# EAGLE design HVRescue_Shield_r212 (EAGLE 5.11)
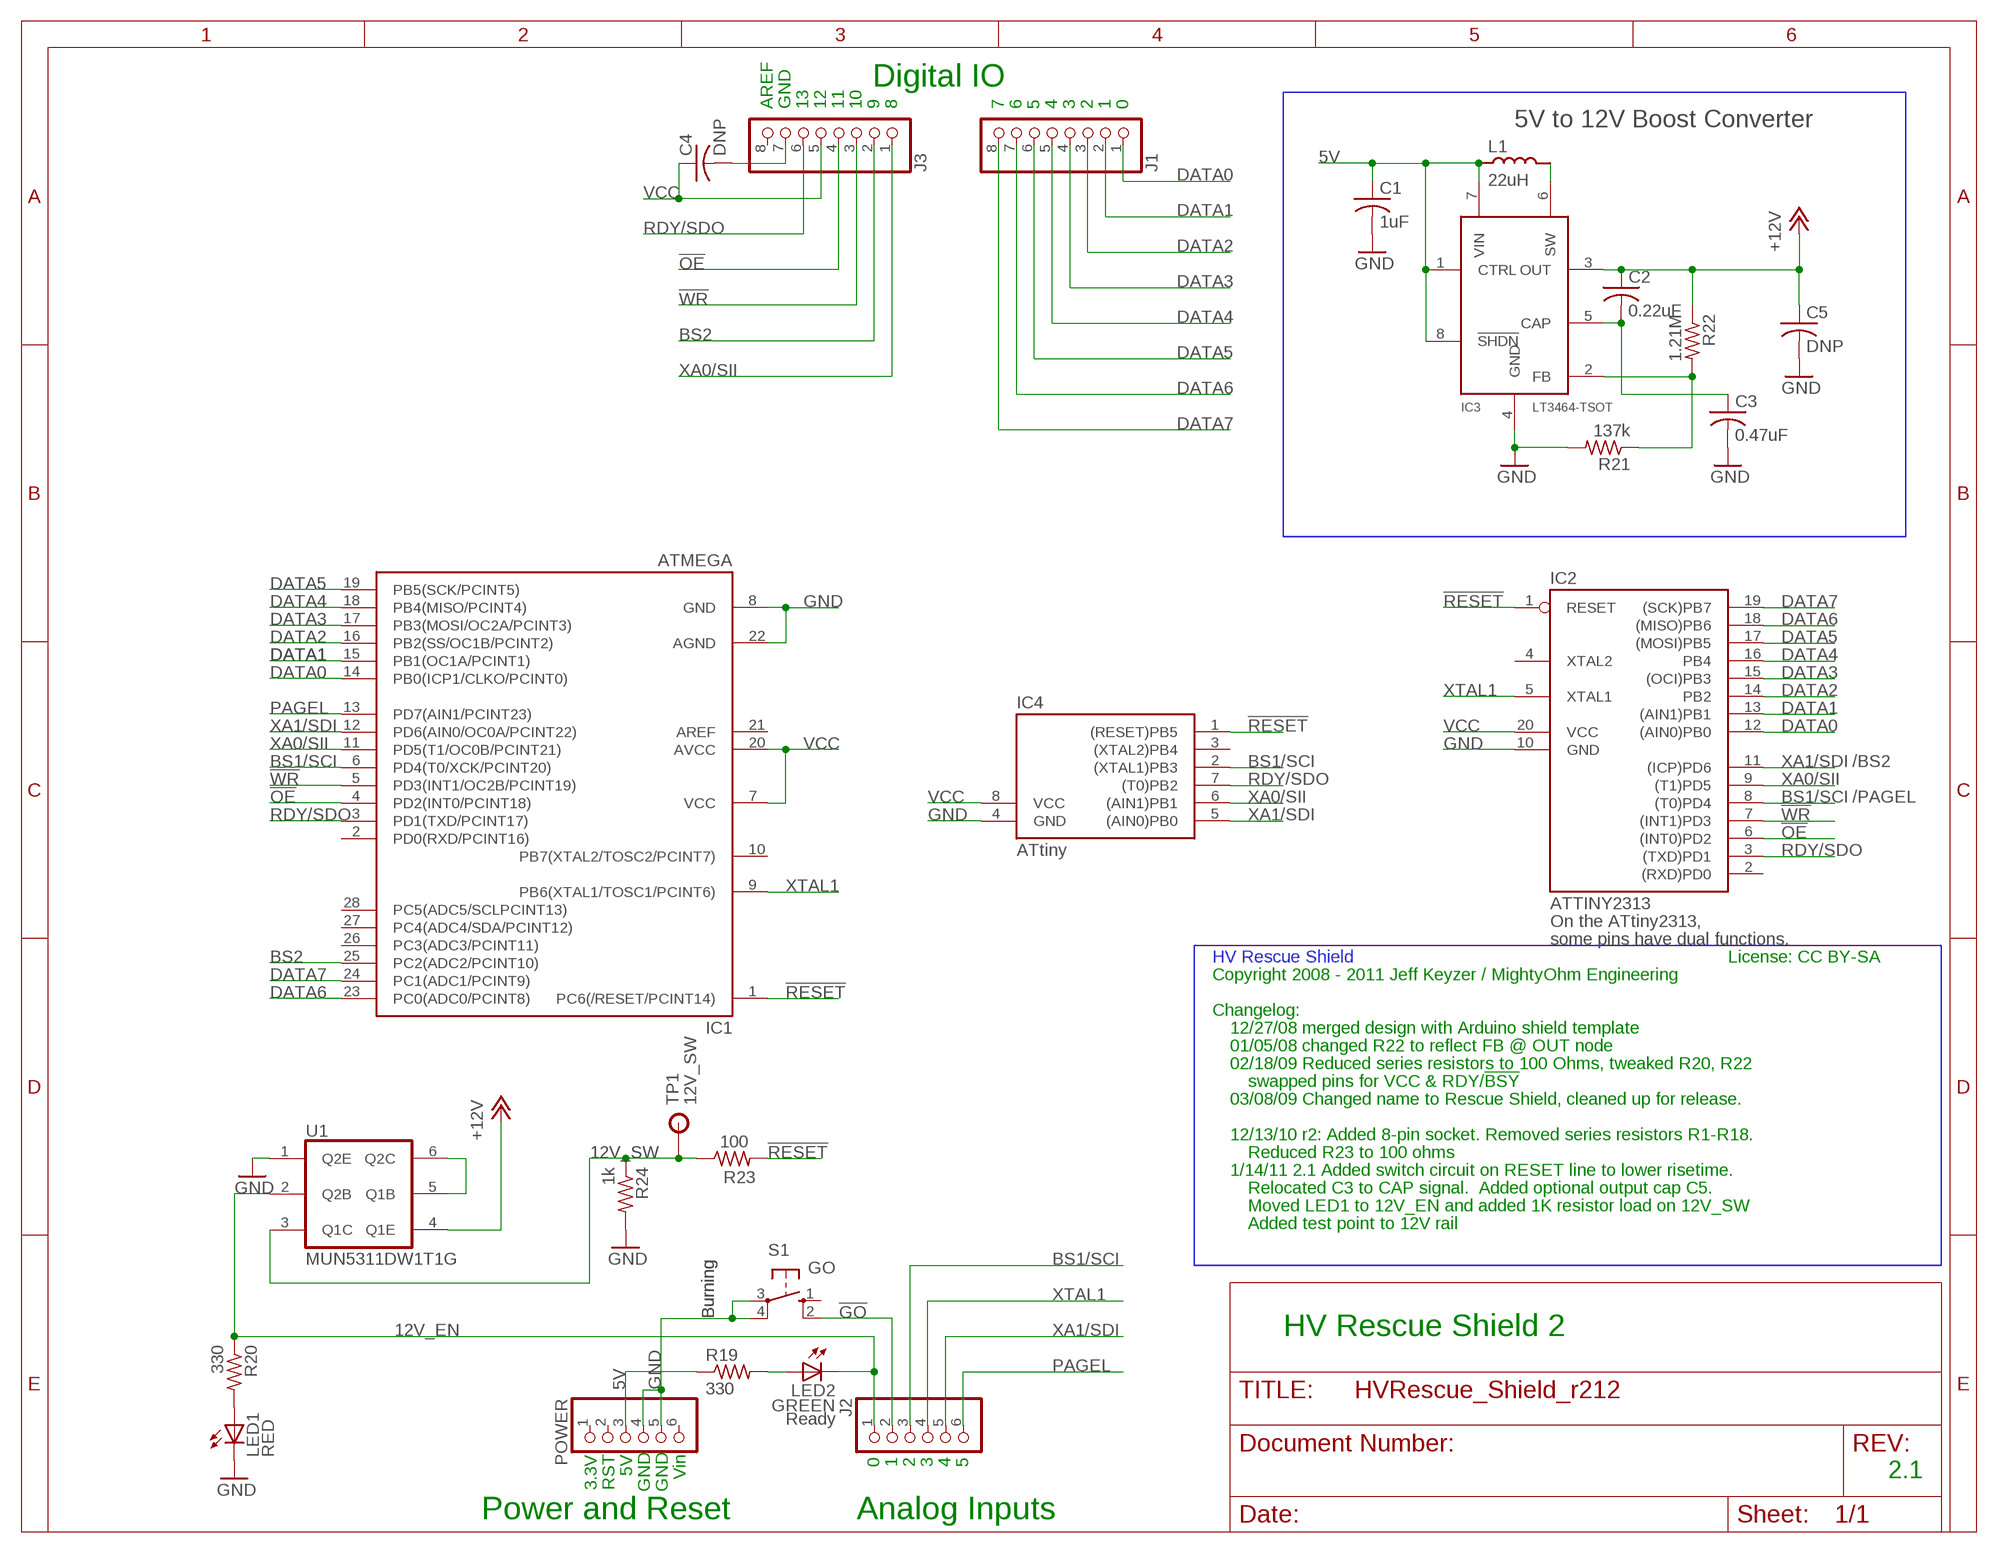
[diagram p0: schematic, sheet 1]

## Parts
C1  1uF  CAP0805  [C0805_IPC]
C2  0.22uF  CAP0805  [C0805_IPC]
C3  0.47uF  CAP0805  [C0805_IPC]
C4  DNP  C-US025-025X050  [C025-025X050]
C5  DNP  CAP0805  [C0805_IPC]
IC1  ATMEGA  MEGA48/88/168-PU  [DIL28-3]
IC2  ATTINY2313  AT90S2313P  [DIL20]
IC3  LT3464-TSOT  [TSOT23-8]
IC4  ATtiny  TINY10P  [DIL08]
J1  PINHD-1X8  [1X08]
J2  PINHD-1X6  [1X06]
J3  PINHD-1X8  [1X08]
L1  22uH  IND0805  [R0805_IPC]
LED1  RED  LED3MM  [LED3MM]
LED2  GREEN  LED3MM  [LED3MM]
POWER  PINHD-1X6  [1X06]
R19  330  R-US_0204/5  [0204/5]
R20  330  R-US_0204/5  [0204/5]
R21  137k  RES0805  [R0805_IPC]
R22  1.21M  RES0805  [R0805_IPC]
R23  100  R-US_0204/5  [0204/5]
R24  1k  RES0805  [R0805_IPC]
S1  GO  10-XX  [B3F-10XX]
TP1  12V_SW  TPPTH  [TP_PTH]
U1  MUN5311DW1T1G  MUN5311  [SOT363]

## Nets
5V: C1.1 IC3.1(CTRL) IC3.7(VIN) IC3.8(!SHDN) L1.1 POWER.3 R19.1
12V_EN: J2.1 LED2.K(C) R20.1 U1.2(Q2B)
12V_SW: R23.1 R24.1 TP1.P$1(TP) U1.3(Q1C)
!GO: J2.2 S1.2(S1)
!OE: IC1.4(PD2(INT0/PCINT18)) IC2.6((INT0)PD2) J3.4
!RESET: IC1.1(PC6(/RESET/PCINT14)) IC2.1(RESET) IC4.1((RESET)PB5) R23.2
!WR: IC1.5(PD3(INT1/OC2B/PCINT19)) IC2.7((INT1)PD3) J3.3
+12V: C2.1 C5.1 IC3.3(OUT) R22.1 U1.4(Q1E)
BS1/SCI: IC1.6(PD4(T0/XCK/PCINT20)) IC2.8((T0)PD4) IC4.2((XTAL1)PB3) J2.3
BS2: IC1.25(PC2(ADC2/PCINT10)) J3.2
CAP: C2.2 C3.1 IC3.5(CAP)
DATA0: IC1.14(PB0(ICP1/CLKO/PCINT0)) IC2.12((AIN0)PB0) J1.1
DATA1: IC1.15(PB1(OC1A/PCINT1)) IC2.13((AIN1)PB1) J1.2
DATA2: IC1.16(PB2(SS/OC1B/PCINT2)) IC2.14(PB2) J1.3
DATA3: IC1.17(PB3(MOSI/OC2A/PCINT3)) IC2.15((OCI)PB3) J1.4
DATA4: IC1.18(PB4(MISO/PCINT4)) IC2.16(PB4) J1.5
DATA5: IC1.19(PB5(SCK/PCINT5)) IC2.17((MOSI)PB5) J1.6
DATA6: IC1.23(PC0(ADC0/PCINT8)) IC2.18((MISO)PB6) J1.7
DATA7: IC1.24(PC1(ADC1/PCINT9)) IC2.19((SCK)PB7) J1.8
GND: C1.2 C3.2 C5.2 IC1.8(GND) IC1.22(AGND) IC2.10(GND) IC3.4(GND) IC4.4(GND) LED1.K(C) POWER.4 POWER.5 R21.2 R24.2 S1.3(P) S1.4(P1) U1.1(Q2E)
N$1: U1.5(Q1B) U1.6(Q2C)
N$2: LED1.A R20.2
N$7: LED2.A R19.2
N$21: C4.2 J3.7
N$44: IC3.6(SW) L1.2
N$46: IC3.2(FB) R21.1 R22.2
PAGEL: IC1.13(PD7(AIN1/PCINT23)) J2.6
RDY/SDO: IC1.3(PD1(TXD/PCINT17)) IC2.3((TXD)PD1) IC4.7((T0)PB2) J3.6
VCC: C4.1 IC1.7(VCC) IC1.20(AVCC) IC2.20(VCC) IC4.8(VCC) J3.5
XA0/SII: IC1.11(PD5(T1/OC0B/PCINT21)) IC2.9((T1)PD5) IC4.6((AIN1)PB1) J3.1
XA1/SDI: IC1.12(PD6(AIN0/OC0A/PCINT22)) IC2.11((ICP)PD6) IC4.5((AIN0)PB0) J2.5
XTAL1: IC1.9(PB6(XTAL1/TOSC1/PCINT6)) IC2.5(XTAL1) J2.4
Unconnected: IC1.2(PD0(RXD/PCINT16)) IC1.10(PB7(XTAL2/TOSC2/PCINT7)) IC1.21(AREF) IC1.26(PC3(ADC3/PCINT11)) IC1.27(PC4(ADC4/SDA/PCINT12)) IC1.28(PC5(ADC5/SCLPCINT13)) IC2.2((RXD)PD0) IC2.4(XTAL2) IC4.3((XTAL2)PB4) J3.8 POWER.1 POWER.2 POWER.6 S1.1(S)

## Notes on the sheet
- Digital IO
- AREF | GND | 13 | 12 | 11 | 10 | 9 | 8 | 7 | 6 | 5 | 4 | 3 | 2 | 1 | 0
- 5V to 12V Boost Converter
- /BS2
- /PAGEL
- On the ATtiny2313,
- some pins have dual functions.
- HV Rescue Shield | License: CC BY-SA
- Copyright 2008 - 2011 Jeff Keyzer / MightyOhm Engineering
- Changelog:
- 12/27/08 merged design with Arduino shield template
- 01/05/08 changed R22 to reflect FB @ OUT node
- 02/18/09 Reduced series resistors to 100 Ohms, tweaked R20, R22
- swapped pins for VCC & RDY/!BSY
- 03/08/09 Changed name to Rescue Shield, cleaned up for release.
- 12/13/10 r2: Added 8-pin socket. Removed series resistors R1-R18.
- Reduced R23 to 100 ohms
- 1/14/11 2.1 Added switch circuit on RESET line to lower risetime.
- Relocated C3 to CAP signal.  Added optional output cap C5.
- Moved LED1 to 12V_EN and added 1K resistor load on 12V_SW
- Added test point to 12V rail
- Burning | Burning
- HV Rescue Shield 2
- Ready
- 0 | 1 | 2 | 3 | 4 | 5
- 5V | Vin | 2.1
- 3.3V | RST | GND | GND
- Power and Reset | Analog Inputs

## Library data of the parts
C1-C3 C5 = passives:CAP: Capacitor, non-polarized
C4 = rcl:C-US: CAPACITOR, American symbol
IC1 = avr-4:MEGA48/88/168-PU
IC2 = atmel:AT90S2313: MICROCONTROLLER 2 Kbytes FLASH 128 bytes SRAM 128 bytes EEPROM UART; OC_FARNELL: unknown; OC_NEWARK: unknown
IC3 = mightyohm:LT3464: LT3464 - Linear Technology Micropower Boost Converter with Schottky and Output Disconnect
IC4 = avr-6:TINY10: MICROCONTROLLER 1 Kbytes ROM
J1 J3 = mightyohm:PINHD-1X8: PIN HEADER
J2 POWER = mightyohm:PINHD-1X6: PIN HEADER
L1 = passives:IND: Inductor
LED1 LED2 = mightyohm:LED: MightyOhm Engineering Light Emitting Diodes (LEDs)
R19 R20 R23 = rcl:R-US_: RESISTOR, American symbol
R21 R22 R24 = passives:RES: Resistor
S1 = switch-omron:10-XX: OMRON SWITCH; MPN: B3F-1000; OC_FARNELL: 176432; OC_NEWARK: 36M3542
TP1 = connectors:TP: Test Point JSK 1/14/11
U1 = mightyohm:MUN5311: Complimentary NPN/PNP with bias resistors.

## Net classes
0 default: width 0.305 mm, drill 0.508 mm, clearance 0.203 mm
1 power: width 0.61 mm, drill 0.508 mm, clearance 0.152 mm
2 gnd: width 0.305 mm, drill 0.508 mm, clearance 0.152 mm
3 usbvcc: width 0.508 mm, drill 0.508 mm, clearance 0.152 mm
4 aref: width 0.406 mm

## Board
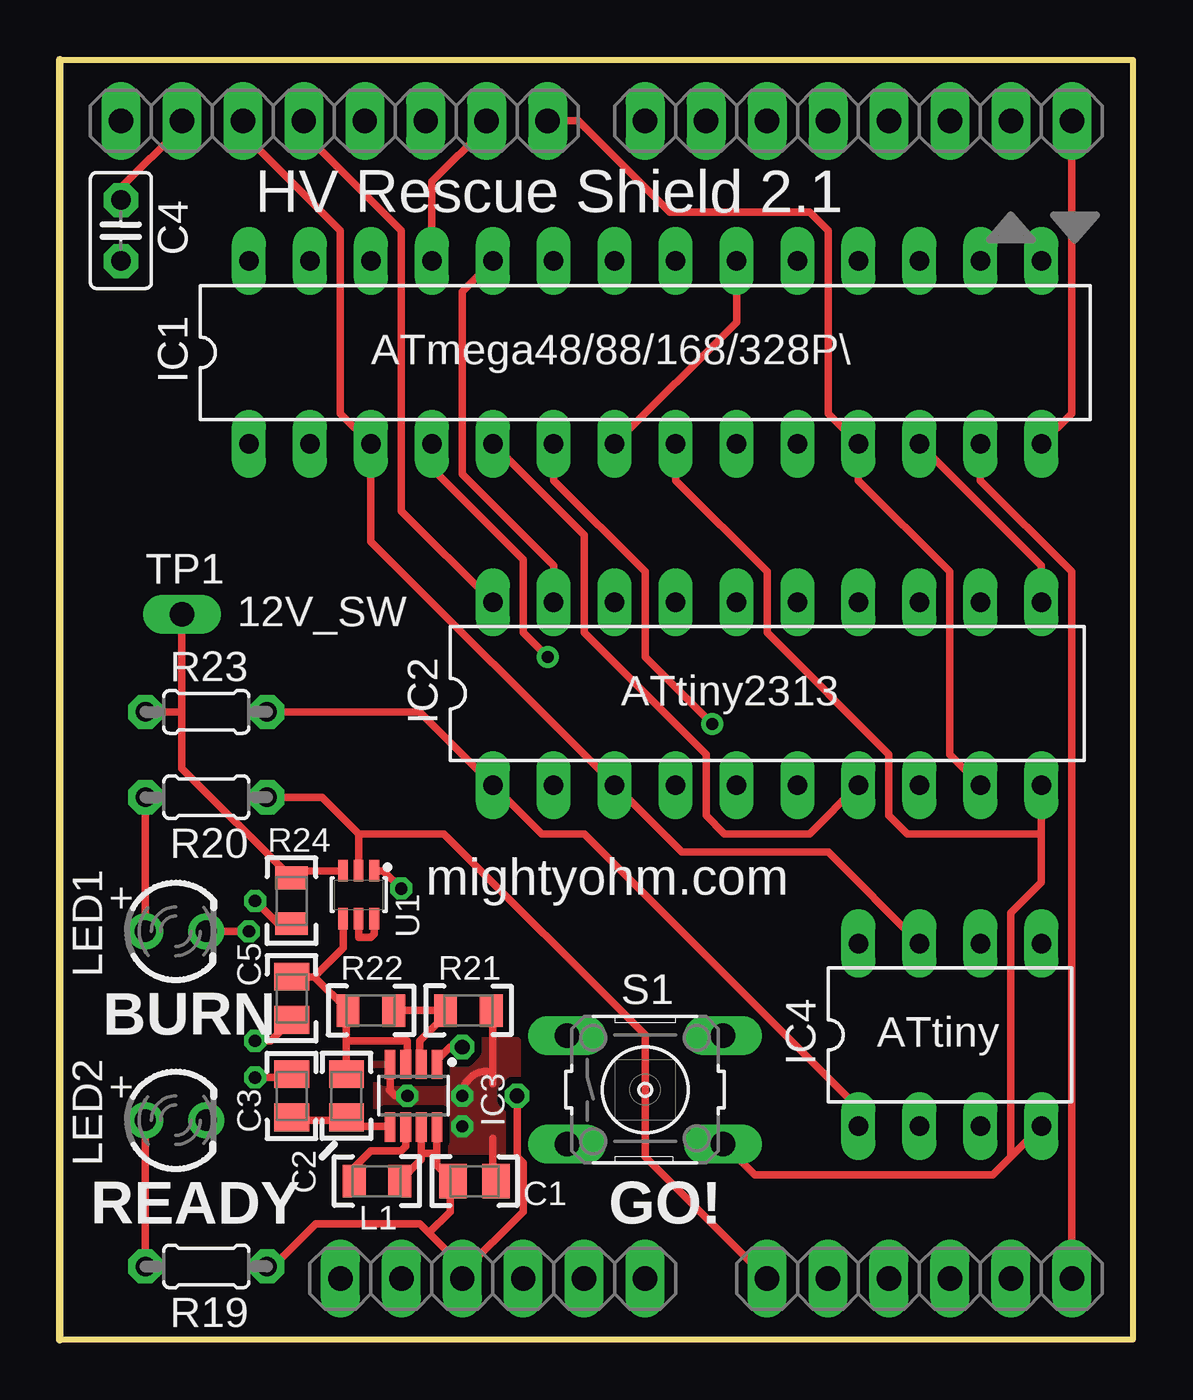
[diagram p1: board, top side]
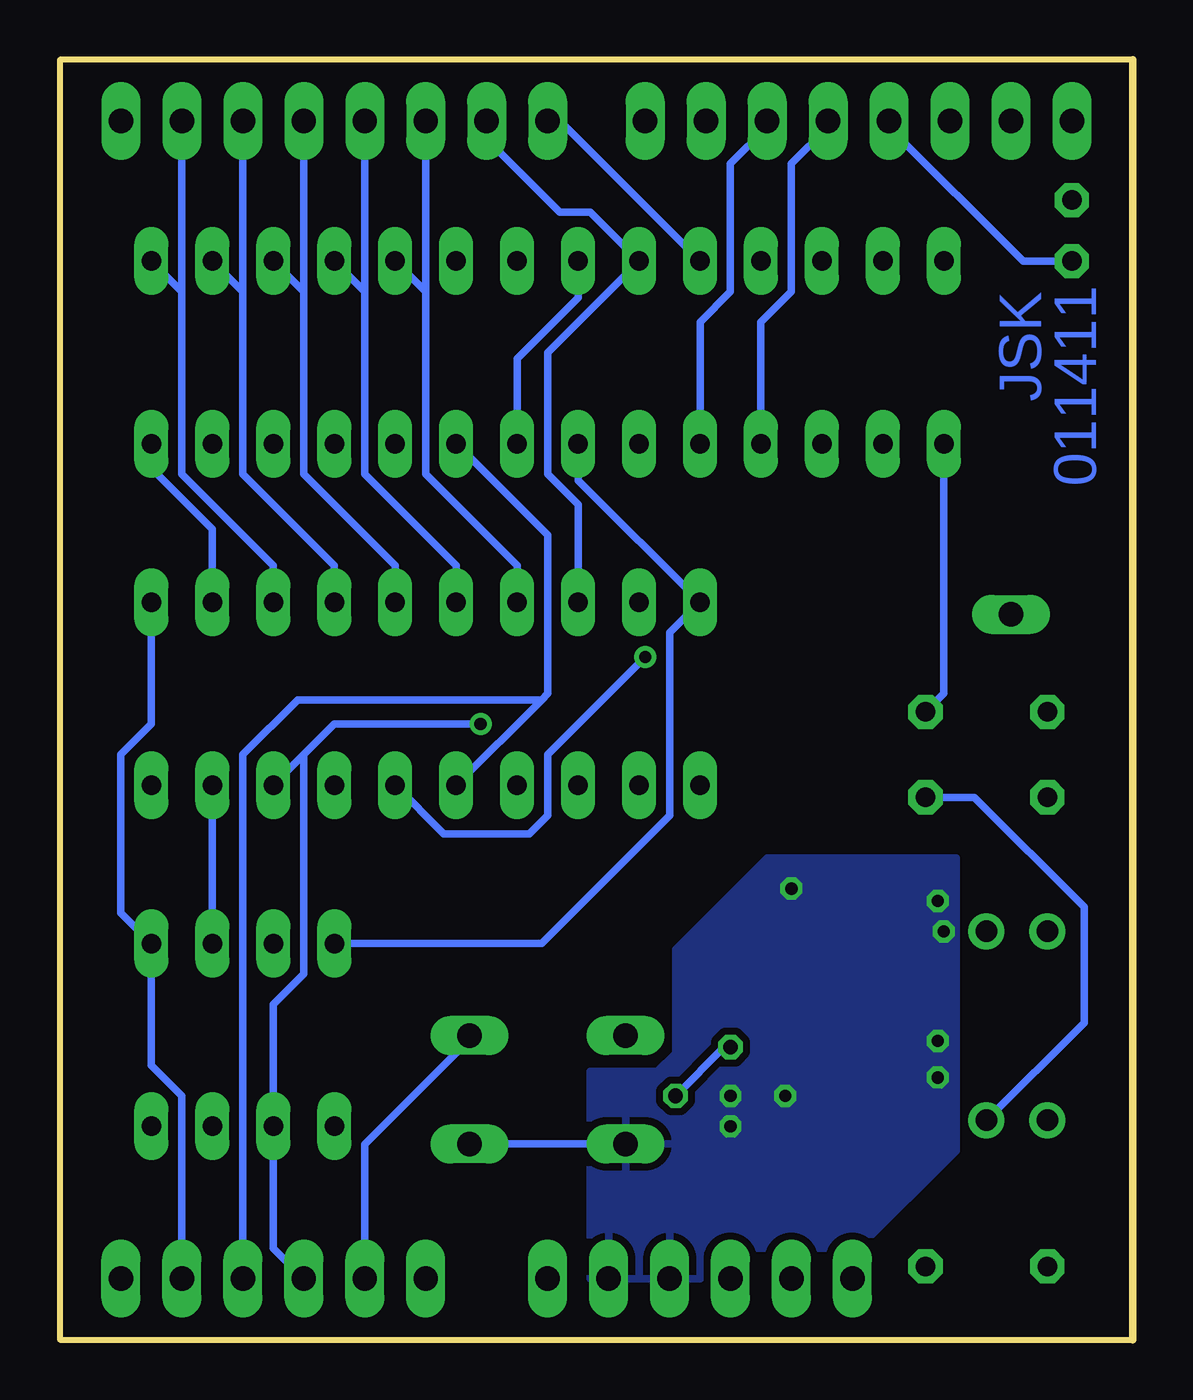
[diagram p2: board, bottom side, seen from below]

Size 44.7 x 53.34 mm. Coordinates in mm from the lower left corner, seen from the top.
Outline: 0,53.34 44.7,53.34 44.7,0 0,0 0,53.34
Copper layers (1*16): Top 0.035mm / dielectric 1.5mm / Bottom 0.0356mm
Design rules "generic_2l": minimum track width 8mil, minimum drill 20mil, track to track 8mil, track to pad 8mil, pad to pad 8mil, via to via 8mil, smd to smd 0mil, copper to edge 15mil, drill to drill 10mil, minimum pad ring 12mil, minimum via ring 8mil, stop-mask expansion 4mil, vias tented up to drill 25mil, thermal gap 12mil
tRestrict: area -18.5,3.6 to -3.3,17
bRestrict: area -18.5,3.6 to -3.3,17

### Footprints (pad centres in the part's own frame; a part is rotated, then mirrored left to right if it is on the bottom)
C0805_IPC = smd 1.15 x 1.45: 1 -0.9,0; 2 0.9,0
C025-025X050 = drill 0.813 octagon: 1 -1.27,0; 2 1.27,0
DIL28-3 = drill 0.813 long: 1 -16.51,-3.81; 2 -13.97,-3.81; 3 -11.43,-3.81; 4 -8.89,-3.81; 5 -6.35,-3.81; 6 -3.81,-3.81; 7 -1.27,-3.81; 8 1.27,-3.81; 9 3.81,-3.81; 10 6.35,-3.81; 11 8.89,-3.81; 12 11.43,-3.81; 13 13.97,-3.81; 14 16.51,-3.81; 15 16.51,3.81; 16 13.97,3.81; 17 11.43,3.81; 18 8.89,3.81; 19 6.35,3.81; 20 3.81,3.81; 21 1.27,3.81; 22 -1.27,3.81; 23 -3.81,3.81; 24 -6.35,3.81; 25 -8.89,3.81; 26 -11.43,3.81; 27 -13.97,3.81; 28 -16.51,3.81
DIL20 = drill 0.813 long: 1 -11.43,-3.81; 2 -8.89,-3.81; 3 -6.35,-3.81; 4 -3.81,-3.81; 5 -1.27,-3.81; 6 1.27,-3.81; 7 3.81,-3.81; 8 6.35,-3.81; 9 8.89,-3.81; 10 11.43,-3.81; 11 11.43,3.81; 12 8.89,3.81; 13 6.35,3.81; 14 3.81,3.81; 15 1.27,3.81; 16 -1.27,3.81; 17 -3.81,3.81; 18 -6.35,3.81; 19 -8.89,3.81; 20 -11.43,3.81
TSOT23-8 = smd 0.445 x 1.22: 1 -0.975,-1.31; 2 -0.325,-1.31; 3 0.325,-1.31; 4 0.975,-1.31; 5 0.975,1.31; 6 0.325,1.31; 7 -0.325,1.31; 8 -0.975,1.31
DIL08 = drill 0.813 long: 1 -3.81,-3.81; 2 -1.27,-3.81; 3 1.27,-3.81; 4 3.81,-3.81; 5 3.81,3.81; 6 1.27,3.81; 7 -1.27,3.81; 8 -3.81,3.81
1X08 = drill 1.016 long: 1 -8.89,0; 2 -6.35,0; 3 -3.81,0; 4 -1.27,0; 5 1.27,0; 6 3.81,0; 7 6.35,0; 8 8.89,0
1X06 = drill 1.016 long: 1 -6.35,0; 2 -3.81,0; 3 -1.27,0; 4 1.27,0; 5 3.81,0; 6 6.35,0
R0805_IPC = smd 0.95 x 1.35: 1 -0.95,0; 2 0.95,0
LED3MM = drill 0.889 round: A -1.27,0; K 1.27,0
0204/5 = drill 0.813 octagon: 1 -2.54,0; 2 2.54,0
B3F-10XX = drill 1.016 long: 1 -3.251,2.261; 2 3.251,2.261; 3 -3.251,-2.261; 4 3.251,-2.261
TP_PTH = drill 1.016 long: P$1 0,0
SOT363 = smd 0.9 x 0.4: 1 -1,0.65; 2 -1,0; 3 -1,-0.65; 4 1,-0.65; 5 1,0; 6 1,0.65

### Placement (x,y rotation side)
C1  17.27,6.6 0 top
C2  11.94,10.16 270 top
C3  9.65,10.16 90 top
C4  2.54,46.23 90 top
C5  9.65,14.22 270 top
DRILEGEND  [DRILEGEND]  -18.71,-4.04 0 top  (outside the outline)
IC1  24.38,41.15 0 top
IC2  29.46,26.92 0 top
IC3  14.73,10.16 180 top
IC4  37.08,12.7 0 top
J1  33.27,50.8 180 top
J2  35.81,2.54 0 top
J3  11.43,50.8 180 top
L1  13.21,6.6 180 top
LED1  4.83,17.02 0 top
LED2  4.83,9.14 0 top
POWER  18.03,2.54 0 top
R19  6.1,3.05 180 top
R20  6.1,22.61 180 top
R21  17.02,13.72 0 top
R22  12.95,13.72 0 top
R23  6.1,26.16 0 top
R24  9.65,18.29 270 top
S1  24.38,10.41 0 top
TP1  5.08,30.23 180 top
U1  12.45,18.54 270 top

### Tracks (layer width: path | path; a pad name or v marks a point on that pad's centre or on a via)
5V  (via drill 0.61)
  Top 0.305: R19.1 9.14,3.05 9.14,3.3 10.67,4.83 14.99,4.83 15.37,4.45 | 15.37,4.45 16.76,3.05 POWER.3 16.76,2.79 19.3,5.33 19.3,7.37 19.05,7.62 v19.05,10.16 | 15.37,4.45 16.26,5.33 16.26,6.6 C1.1 | C1.1 16.51,6.74 | IC3.1 15.71,11.64 16.26,12.19 v16.76,12.19 | C1.1 16.37,6.72 | 14.16,6.79 L1.1 15.06,7.5 15.06,7.76 | 15.06,7.76 IC3.7 | 15.71,7.76 IC3.8 | C1.1 15.71,7.27 15.71,7.76 | 15.71,7.76 15.06,7.76
  Bottom 0.305: v16.76,12.19 17.02,12.19 v19.05,10.16
12V_EN
  Top 0.305: J2.1 24.38,7.62 24.38,12.7 16,21.08 12.45,21.08 | 12.45,21.08 U1.2 | 12.45,21.08 10.92,22.61 R20.1
  Bottom 0.305: LED2.K 2.03,13.21 2.03,18.03 6.6,22.61 R20.1
12V_SW
  Top 0.305: 5.08,26.16 R23.1 | 5.08,26.16 5.08,23.81 R24.1 9.96,19.54 U1.3 | 5.08,26.16 TP1.P$1
!GO
  Bottom 0.305: J2.2 32,8.13 27.69,12.45 27.69,12.62 S1.2
!OE  (via drill 0.51)
  Top 0.305: v20.32,28.45 19.3,29.46 19.3,32.51 15.49,36.32 IC1.4
  Bottom 0.305: IC1.4 15.49,42.42 14.22,43.69 14.22,49.02 12.7,50.55 J3.4 | IC2.6 28.7,21.08 25.15,21.08 24.38,21.84 24.38,24.38 v20.32,28.45
!RESET
  Top 0.305: R23.2 14.99,26.16 IC2.1 20.07,21.08 21.84,21.08 33.27,9.65 IC4.1
  Bottom 0.305: IC1.1 7.87,26.92 R23.2
!WR
  Top 0.305: IC2.7 31.24,21.08 27.69,21.08 26.92,21.84 26.92,24.38 21.84,29.46 21.84,33.53 IC1.5
  Bottom 0.305: IC1.5 18.03,42.42 16.76,43.69 16.76,49.02 15.24,50.55 J3.3
+12V
  Top 0.305: IC3.3 14.48,11.54 14.48,12.45 11.94,12.45 | 11.94,13.33 11.94,12.45 | 11.94,12.45 C2.1 | 10.6,15.12 C5.1 9.65,15.4 | 10.6,15.12 R22.1 | U1.4 11.8,16.32 10.6,15.12
  Top 0.406: R22.1 11.94,13.72 11.94,13.33
BS1/SCI  (via drill 0.51)
  Top 0.305: IC1.6 20.57,35.81 24.38,32 24.38,28.45 v27.18,25.65
  Bottom 0.305: J2.3 35.81,3.81 IC4.2 35.81,13.97 34.54,15.24 34.54,24.38 | v27.18,25.65 33.27,25.65 34.54,24.38 | 34.54,24.38 IC2.8
BS2
  Top 0.305: IC1.25 15.49,48.26 17.78,50.55 J3.2
CAP
  Top 0.305: IC3.5 13.72,8.89 12.19,8.89 | 12.19,8.89 12.06,8.89 | 11.94,9.14 12.19,9.14 12.19,8.89 | 11.94,9.14 C2.2 | 11.94,9.14 9.77,9.14 C3.1
DATA0
  Top 0.305: J1.1 42.16,38.61 IC1.14
  Bottom 0.305: IC2.12 38.35,33.78 40.89,36.32 IC1.14
DATA1
  Bottom 0.305: IC2.13 35.81,32.26 39.62,36.07 39.62,43.69 | 39.62,43.69 IC1.15 | 39.62,43.69 J1.2
DATA2
  Bottom 0.305: IC2.14 33.27,32.26 37.08,36.07 37.08,43.69 | 37.08,43.69 IC1.16 | 37.08,43.69 J1.3
DATA3
  Bottom 0.305: IC2.15 30.73,32.26 34.54,36.07 34.54,43.69 | 34.54,43.69 IC1.17 | 34.54,43.69 J1.4
DATA4
  Bottom 0.305: IC2.16 28.19,32.26 32,36.07 32,43.69 | 32,43.69 IC1.18 | 32,43.69 J1.5
DATA5
  Bottom 0.305: IC2.17 25.65,32.26 29.46,36.07 29.46,43.69 | 29.46,43.69 IC1.19 | 29.46,43.69 J1.6
DATA6
  Bottom 0.305: IC2.18 23.11,34.8 24.38,36.07 24.38,41.15 IC1.23 22.61,46.99 23.88,46.99 26.92,50.04 J1.7
DATA7
  Top 0.305: IC2.19 20.57,32.26 16.76,36.07 16.76,43.69 IC1.24
  Bottom 0.305: J1.8 23.88,50.8 IC1.24
GND  (via drill 0.51)
  Top 0.305: 39.62,7.62 38.86,6.86 28.96,6.86 27.66,8.15 S1.4 | 39.62,7.62 IC4.4 | 40.89,21.08 40.89,19.05 39.62,17.78 39.62,7.62 | 40.89,21.08 IC2.10 | IC1.8 25.65,35.81 29.46,32 29.46,29.46 34.54,24.38 34.54,21.84 35.31,21.08 40.89,21.08 | C3.2 9.91,11.31 | C3.2 9.54,11.18 | U1.1 13.48,19.54 v14.22,18.8 | LED1.K v7.87,17.02 | v14.48,10.16 13.97,10.16 13.72,10.41 13.76,10.46 IC3.4 | 9.4,12.95 9.4,13.21 9.65,13.21 C5.2 8.77,12.45 v8.13,12.45 | v8.13,10.92 9.51,10.92 C3.2 | R24.2 9.08,17.34 v8.13,18.29 | R21.2 arc90 17.78,13.53 18.03,13.27 18.03,10.67 | v16.76,10.16 arc-90 17.78,11.18 | C1.2 18.03,6.74 18.29,7 18.03,7.25 18.03,8.38
  Bottom 0.305: POWER.5 21.84,3.05 | IC1.22 23.11,43.43 25.65,40.89 IC1.8 | S1.3 S1.4 | v14.22,18.8 14.22,19.05
  other vias: 16.76,8.89
  pour Bottom (isolate 0.305): 7.37,7.87 7.37,20.07 15.24,20.07 19.05,16.26 19.05,11.94 19.81,11.18 22.61,11.18 22.61,2.54 18.03,2.54 18.03,3.81 11.43,3.81
  pour Top (isolate 0.305): 13.21,12.45 19.05,12.45 19.05,7.87 13.21,7.87
N$1
  Top 0.305: U1.5 12.45,16.76 12.95,16.76 13.1,16.91 U1.6
N$2
  Top 0.305: LED1.A R20.2
N$7
  Top 0.305: 3.56,4.06 R19.2 LED2.A
N$21
  Top 0.305: C4.2 2.54,48.01 5.08,50.55 J3.7
N$44
  Top 0.305: IC3.6 14.41,8.06 14.22,7.87 12.95,7.87 12.19,7.11 12.19,6.6 L1.2
N$46
  Top 0.305: IC3.2 14.99,11.54 14.99,12.45 15.75,13.21 15.75,13.6 15.95,13.6 R21.1 R22.2
PAGEL
  Top 0.305: IC1.13 38.35,35.81 42.16,32 J2.6
RDY/SDO
  Top 0.305: IC4.7 32,20.32 25.91,20.32 IC2.3 12.95,33.27 IC1.3 11.68,38.61 11.68,46.23 7.62,50.29 J3.6
VCC
  Top 0.305: IC1.20 28.19,42.42 IC1.7 | J3.5 10.16,50.29 14.22,46.23 14.22,34.54 IC2.20
  Bottom 0.305: C4.1 4.57,44.96 10.16,50.55 J3.5 | IC4.8 24.64,16.51 19.3,21.84 19.3,29.46 IC2.20 23.11,35.81 IC1.7
XA0/SII
  Top 0.305: IC2.9 37.08,24.38 37.08,32 33.27,35.81 IC1.11 32,38.61 32,46.23 31.24,46.99 25.4,46.99 21.59,50.8 J3.1
  Bottom 0.305: IC4.6 IC2.9
XA1/SDI
  Top 0.305: IC2.11 40.89,32.26 IC1.12
  Bottom 0.305: J2.5 39.62,10.16 40.89,11.43 IC4.5 42.16,17.78 42.16,24.38 40.89,25.65 IC2.11
XTAL1
  Bottom 0.305: 24.64,26.67 24.38,26.92 24.38,33.53 IC1.9 | 24.64,26.67 IC2.5 | J2.4 37.08,24.38 34.8,26.67 24.64,26.67

### Text on the board
Bottom: 011411 | JSK
tPlace: HV Rescue Shield 2.1 | ATmega48/88/168/328P\ | ATtiny2313 | mightyohm.com | BURN | READY | GO!
tDocu: 3 2 1 0 9 8 | 7 6 5 4 3 2 1 0 | GND | 1 1 1 1 | DIGITAL | AREF | TX | RX | PWM | PWM | PWM | PWM | PWM | PWM | ANALOG IN | RESET | 3V3 | 5V Gnd Vin | 0 1 2 3 4 5